# EAGLE design schematic_r2 (EAGLE 7.4.0)
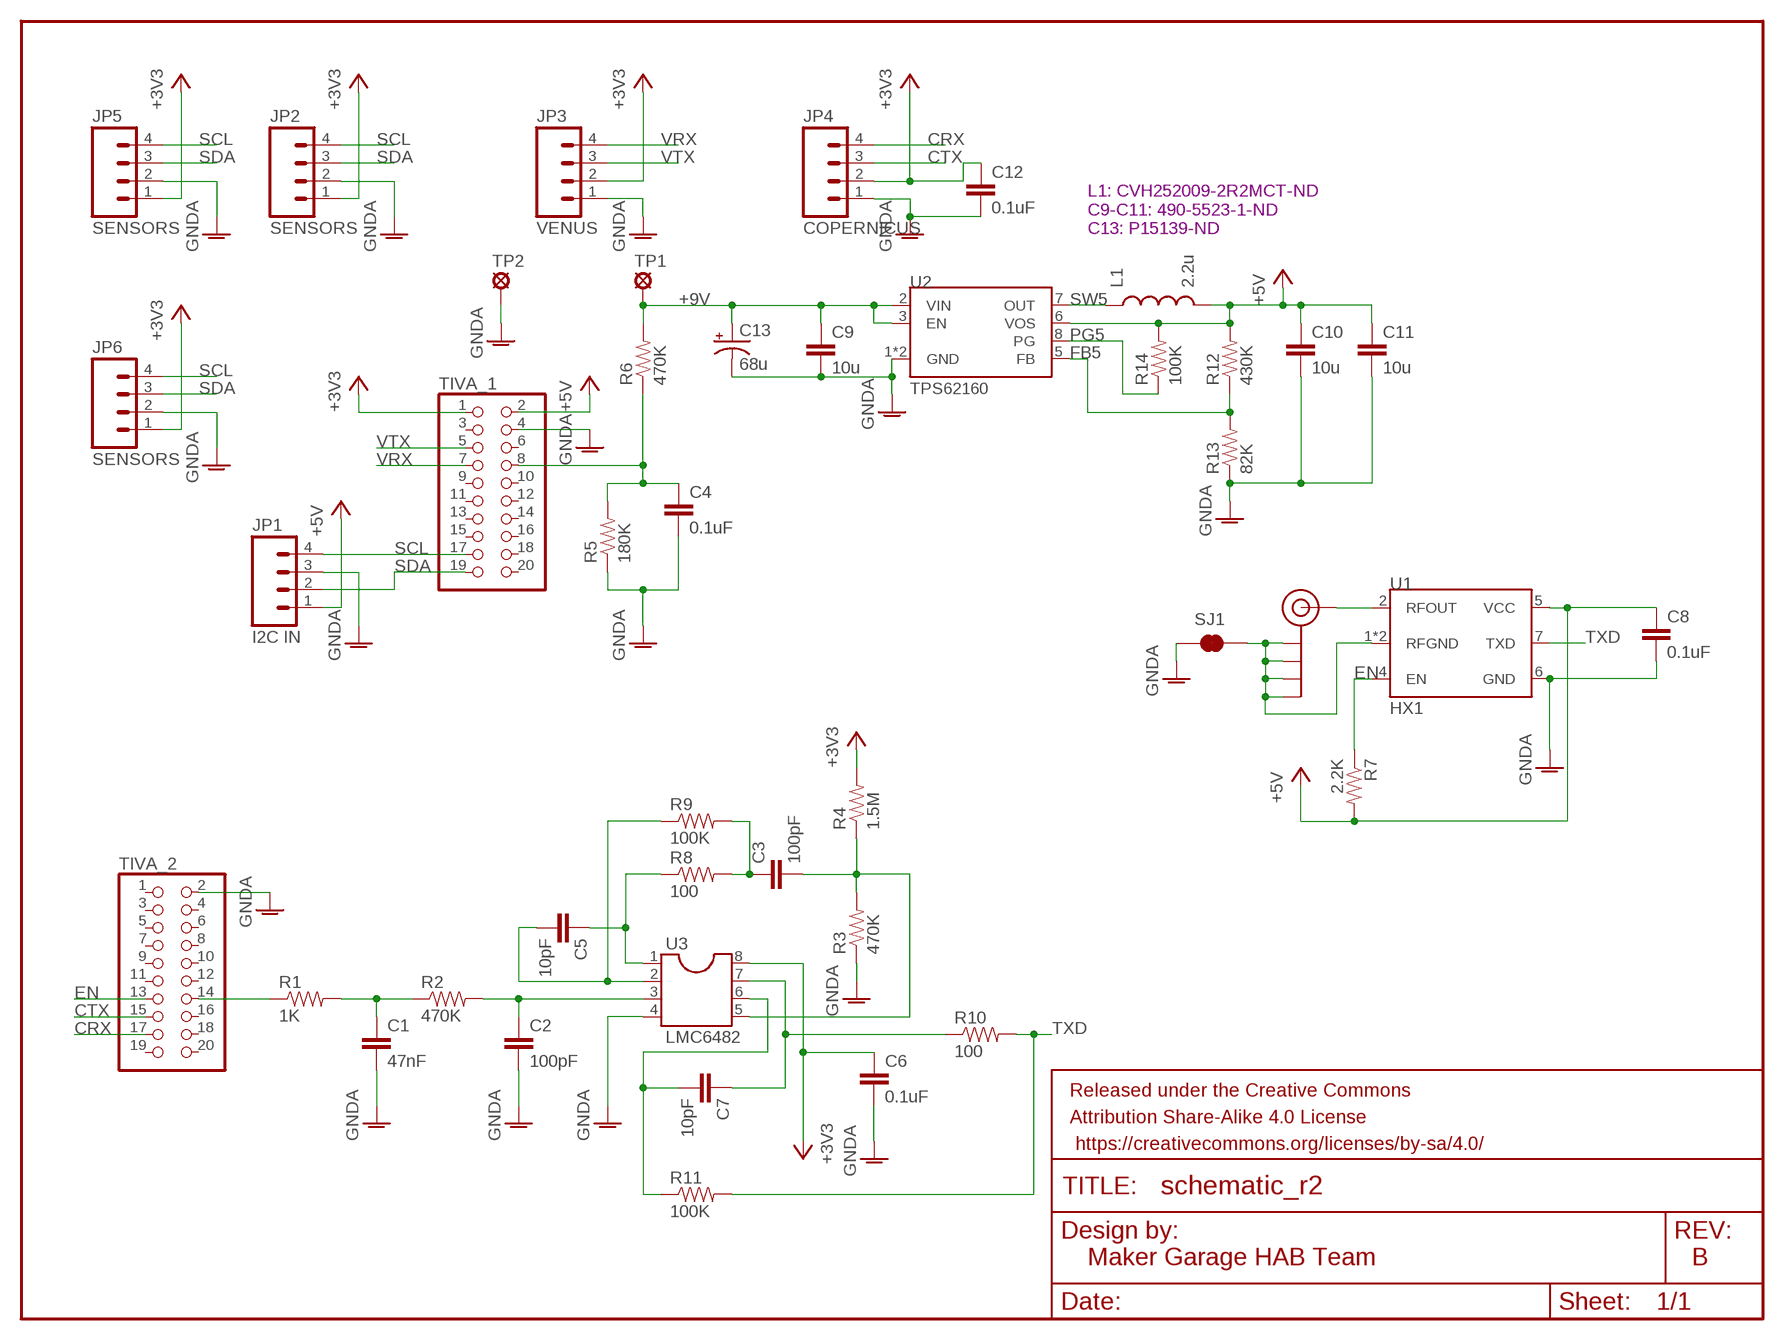
[diagram p0: schematic, sheet 1]

## Parts
C1  47nF  CAP0805  [0805]
C2  100pF  CAP0805  [0805]
C3  100pF  CAP0805  [0805]
C4  0.1uF  CAP0805  [0805]
C5  10pF  CAP0805  [0805]
C6  0.1uF  CAP0805  [0805]
C7  10pF  CAP0805  [0805]
C8  0.1uF  CAP0805  [0805]
C9  10u  CAP0805  [0805]
C10  10u  CAP0805  [0805]
C11  10u  CAP0805  [0805]
C12  0.1uF  CAP0805  [0805]
C13  68u  CAP_POLPTH2  [CPOL-RADIAL-10UF-25V]
FRAME1  FRAME-LETTERNO_PACKAGE  [DUMMY]
J1  SMA_EDGE  [SMA-EDGE]
JP1  I2C IN  M04PTH  [1X04]
JP2  SENSORS  M04PTH  [1X04]
JP3  VENUS  M04PTH  [1X04]
JP4  COPERNICUS  M04PTH  [1X04]
JP5  SENSORS  M04PTH  [1X04]
JP6  SENSORS  M04PTH  [1X04]
L1  2.2u  INDUCTOR  [1008]
R1  1K  RESISTOR0805-RES  [0805]
R2  470K  RESISTOR0805-RES  [0805]
R3  470K  RESISTOR0805-RES  [0805]
R4  1.5M  RESISTOR0805-RES  [0805]
R5  180K  RESISTOR0805-RES  [0805]
R6  470K  RESISTOR0805-RES  [0805]
R7  2.2K  RESISTOR0805-RES  [0805]
R8  100  RESISTOR0805-RES  [0805]
R9  100K  RESISTOR0805-RES  [0805]
R10  100  RESISTOR0805-RES  [0805]
R11  100K  RESISTOR0805-RES  [0805]
R12  430K  RESISTOR0805-RES  [0805]
R13  82K  RESISTOR0805-RES  [0805]
R14  100K  RESISTOR0805-RES  [0805]
SJ1  JUMPER-PAD-2-NC_BY_TRACE  [PAD-JUMPER-2-NC_BY_TRACE_YES_SILK]
TIVA_1  PINHD-2X10  [2X10]
TIVA_2  PINHD-2X10  [2X10]
TP1  MCS08  [MCS08]
TP2  MCS08  [MCS08]
U1  HX1  [1X12]
U2  TPS62160  [MSOP8]
U3  LMC6482  DIL8  [DIL08]

## Nets
+3V3: C6.1 C12.1 JP2.1 JP3.2 JP4.2 JP5.1 JP6.1 R4.2 TIVA_1.1 U3.8
+5V: C8.1 C10.1 C11.1 JP1.1 L1.2 R7.2 R12.2 R14.2 TIVA_1.2 U1.5(VCC) U2.6(VOS)
+9V: C9.1 C13.1(+) R6.2 TP1.MP U2.2(VIN) U2.3(EN)
CRX: JP4.4 TIVA_2.17
CTX: JP4.3 TIVA_2.15
EN: R7.1 TIVA_2.13 U1.4(EN)
FB5: R12.1 R13.2 U2.5(FB)
GNDA: C1.2 C2.2 C4.2 C6.2 C8.2 C9.2 C10.2 C11.2 C12.2 C13.2(-) JP1.3 JP2.2 JP3.1 JP4.1 JP5.2 JP6.2 R3.1 R5.1 R13.1 SJ1.1 TIVA_1.4 TIVA_2.2 TP2.MP U1.6(GND) U2.1(GND) U2.4(GND) U3.4
HPFB: C7.2 R11.1 U3.6
HPIN: C3.1 R8.2 R9.2
HPOUT: C3.2 R3.2 R4.1 U3.5
LPFB: C5.2 R9.1 U3.2
LPOUT: C5.1 R8.1 U3.1
PG5: R14.1 U2.8(PG)
PWMF1: C1.1 R1.2 R2.1
PWMF2: C2.1 R2.2 U3.3
PWMOUT: R1.1 TIVA_2.14
RFGND: J1.GND@0(GND) J1.GND@1(GND) J1.GND@2(GND) J1.GND@3(GND) SJ1.2 U1.1(RFGND) U1.3(RFGND)
RFOUT: J1.SIG(SIGNAL) U1.2(RFOUT)
SCL: JP1.4 JP2.4 JP5.4 JP6.4 TIVA_1.17
SDA: JP1.2 JP2.3 JP5.3 JP6.3 TIVA_1.19
SW5: L1.1 U2.7(OUT)
TXD: R10.2 R11.2 U1.7(TXD)
TXF: C7.1 R10.1 U3.7
VBAT: C4.1 R5.2 R6.1 TIVA_1.8
VRX: JP3.4 TIVA_1.7
VTX: JP3.3 TIVA_1.5
Unconnected: TIVA_1.3 TIVA_1.6 TIVA_1.9 TIVA_1.10 TIVA_1.11 TIVA_1.12 TIVA_1.13 TIVA_1.14 TIVA_1.15 TIVA_1.16 TIVA_1.18 TIVA_1.20 TIVA_2.1 TIVA_2.3 TIVA_2.4 TIVA_2.5 TIVA_2.6 TIVA_2.7 TIVA_2.8 TIVA_2.9 TIVA_2.10 TIVA_2.11 TIVA_2.12 TIVA_2.16 TIVA_2.18 TIVA_2.19 TIVA_2.20

## Notes on the sheet
- L1: CVH252009-2R2MCT-ND
  C9-C11: 490-5523-1-ND
  C13: P15139-ND
- Maker Garage HAB Team | B

## Library data of the parts
C1-C12 = SparkFun-Passives:CAP: Capacitor Standard 0603 ceramic capacitor, and 0.1" leaded capacitor.
C13 = SparkFun-Passives:CAP_POL: Capacitor Polarized These are standard SMD and PTH capacitors. Normally 10uF, 47uF, and 100uF in electrolytic and tantalum varieties. Always verify the external diameter of the through hole cap, it varies with capacity, voltage, and manufacturer. The EIA devices should be standard.
FRAME1 = SparkFun-Aesthetics:FRAME-LETTER: Schematic Frame Standard 8.5x11 US Letter frame; DESIGNER: Nobody; VERSION: v01
J1 = SparkFun-Connectors:SMA_EDGE: SMA Antenna Connector End launch SMA connector. The paste layer has been removed so that the connector can be hand soldered onto the board after reflow.
JP1-JP6 = SparkFun-Connectors:M04: Header 4 Standard 4-pin 0.1" header. Use with straight break away headers (SKU : PRT-00116), right angle break away headers (PRT-00553), swiss pins (PRT-00743), machine pins (PRT-00117), and female headers (PRT-00115). Molex polarized connector foot print use with SKU : PRT-08231 with associated crimp pins and housings. 1MM SMD Version SKU: PRT-10208
L1 = HAB:INDUCTOR: INDUCTOR Standard inductor, with some new packages Why do inductors never come in standard packages!?
R1-R14 = SparkFun-Passives:RESISTOR: Resistor Basic schematic elements and footprints for 0603, 1206, and PTH resistors.
SJ1 = SparkFun-Passives:JUMPER-PAD-2-NC_BY_TRACE
TIVA_1 TIVA_2 = pinhead:PINHD-2X10: PIN HEADER
TP1 TP2 = solpad:MCS08: SOLDER PAD MC S0,8, drill 1.2 mm, distributor Buerklin, 08F130
U1 = HAB:HX1: Radiometrix HX1 High-power VHF Narrow Band 300 mW Transmitter
U2 = HAB:TPS62160: TPS62160 Adjustable switch-mode D-CAP2 regulator
U3 = ic-package:DIL8: Dual In Line / Socket

## Board
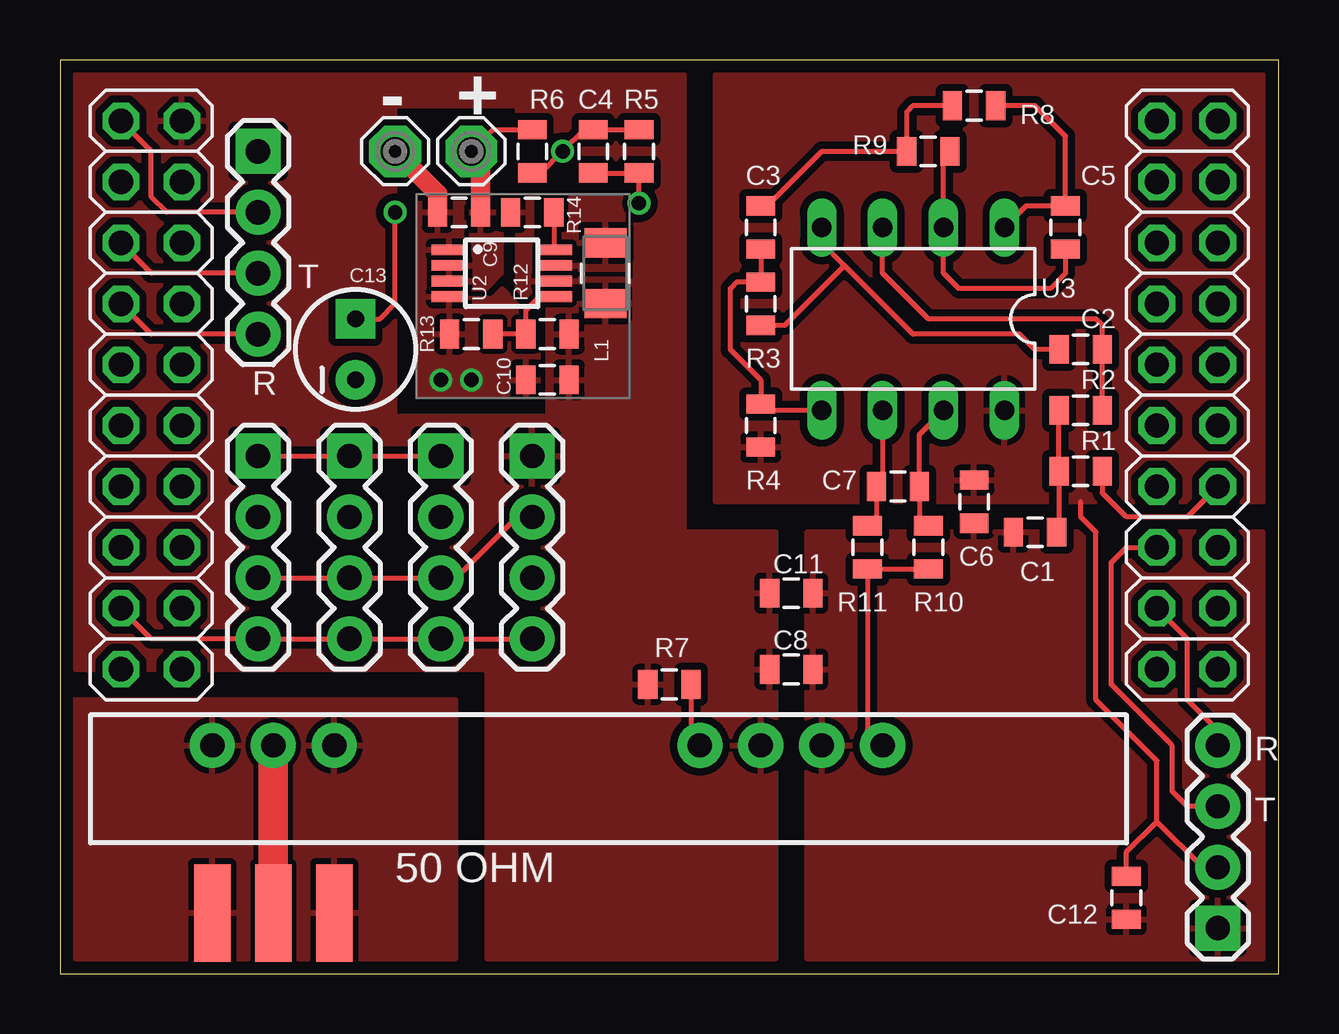
[diagram p1: board, top side]
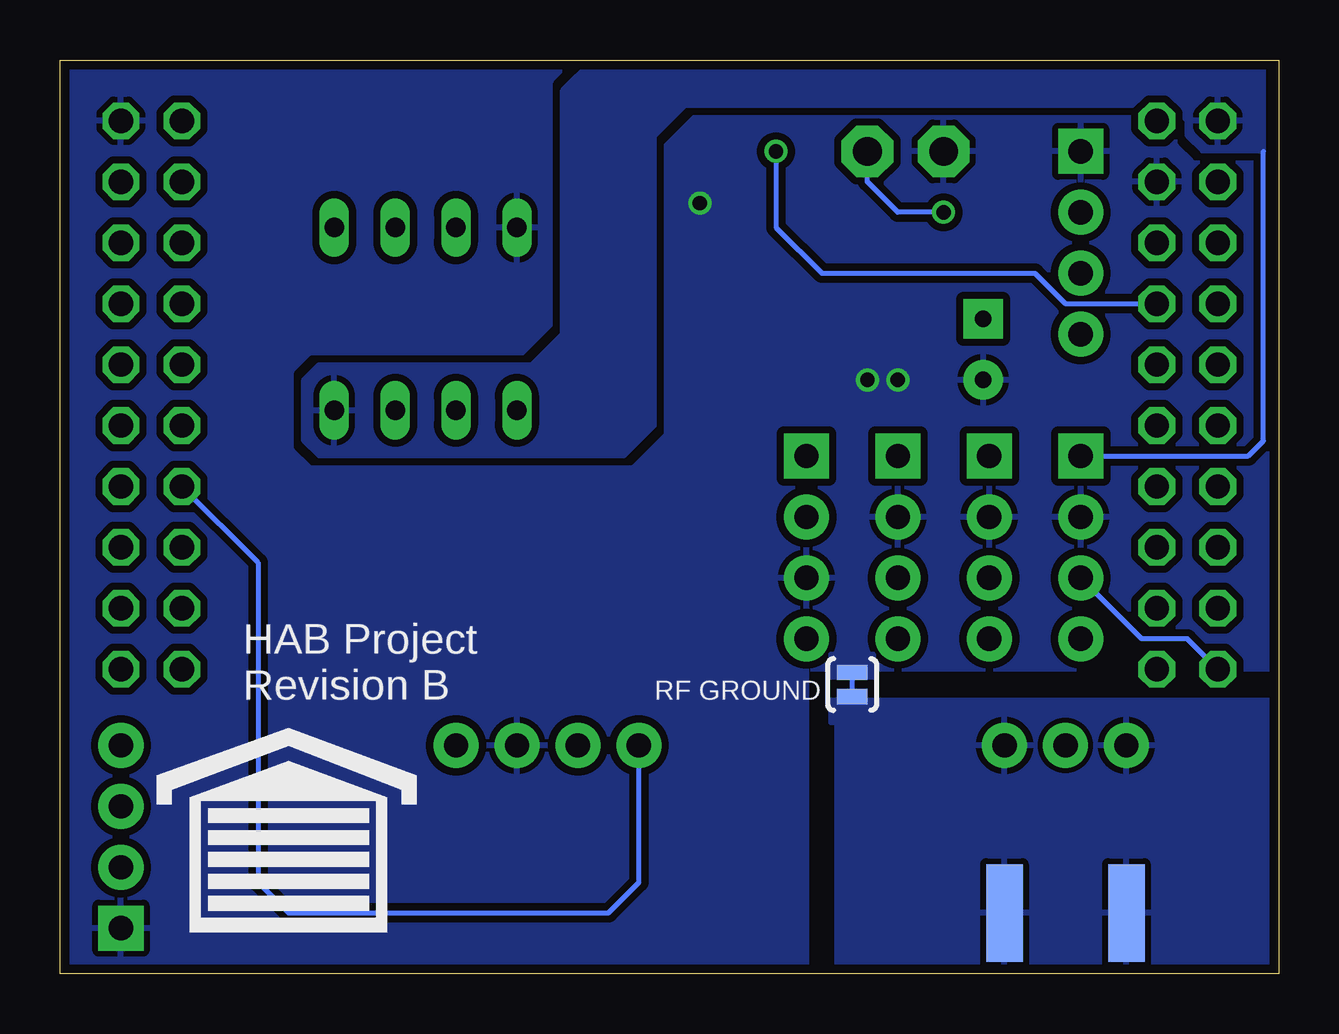
[diagram p2: board, bottom side, seen from below]

Size 50.8 x 38.1 mm. Coordinates in mm from the lower left corner, seen from the top.
Outline: 0,0 50.8,0 50.8,38.1 0,38.1 0,0
Copper layers (1*16): Top 0.0356mm / dielectric 1.5011mm / Bottom 0.0356mm
Design rules "LaenPCBOrder *": minimum track width 6mil, minimum drill 13mil, track to track 6mil, track to pad 6mil, pad to pad 6mil, via to via 6mil, smd to smd 6mil, copper to edge 15mil, drill to drill 6mil, minimum pad ring 7mil, minimum via ring 7mil, stop-mask expansion 3mil, vias tented up to drill 0mil, thermal gap 10mil

### Footprints (pad centres in the part's own frame; a part is rotated, then mirrored left to right if it is on the bottom)
0805 = smd 0.8 x 1.2: 1 -0.9,0; 2 0.9,0
CPOL-RADIAL-10UF-25V = drill 0.7 pad 1.651 square: 1 1.27,0 | drill 0.7 pad 1.651: 2 -1.27,0
SMA-EDGE = smd 1.524 x 4.064: GND@0 0,0; GND@1 5.08,0; SIG 2.54,0 | smd 1.524 x 4.064 bottom: GND@2 0,0; GND@3 5.08,0
1X04 = drill 1.016 pad 1.88 square: 1 0,0 | drill 1.016 pad 1.88: 2 2.54,0; 3 5.08,0; 4 7.62,0
1008 = smd 1.753 x 1.219: 1 0,1.27; 2 0,-1.27
PAD-JUMPER-2-NC_BY_TRACE_YES_SILK = smd 0.635 x 1.27: 1 -0.508,0; 2 0.508,0
2X10 = drill 1.016 octagon: 1 -11.43,-1.27; 2 -11.43,1.27; 3 -8.89,-1.27; 4 -8.89,1.27; 5 -6.35,-1.27; 6 -6.35,1.27; 7 -3.81,-1.27; 8 -3.81,1.27; 9 -1.27,-1.27; 10 -1.27,1.27; 11 1.27,-1.27; 12 1.27,1.27; 13 3.81,-1.27; 14 3.81,1.27; 15 6.35,-1.27; 16 6.35,1.27; 17 8.89,-1.27; 18 8.89,1.27; 19 11.43,-1.27; 20 11.43,1.27
MCS08 = drill 1.194 pad 2.159 octagon: MP 0,0
1X12 = drill 1.016 pad 1.88: 1 0,0; 2 2.54,0; 3 5.08,0; 4 20.32,0; 5 22.86,0; 6 25.4,0; 7 27.94,0
MSOP8 = smd 0.45 x 1.45: 1 -0.975,-2.2; 2 -0.325,-2.2; 3 0.325,-2.2; 4 0.975,-2.2; 5 0.975,2.2; 6 0.325,2.2; 7 -0.325,2.2; 8 -0.975,2.2
DIL08 = drill 0.813 long: 1 -3.81,-3.81; 2 -1.27,-3.81; 3 1.27,-3.81; 4 3.81,-3.81; 5 3.81,3.81; 6 1.27,3.81; 7 -1.27,3.81; 8 -3.81,3.81

### Placement (x,y rotation side)
C1  40.64,18.41 180 top
C2  42.55,26.04 180 top
C3  29.21,31.11 270 top
C4  22.23,34.29 270 top
C5  41.91,31.11 270 top
C6  38.1,19.68 270 top
C7  34.92,20.32 180 top
C8  30.48,12.7 0 top
C9  16.64,31.75 180 top
C10  20.32,24.77 180 top
C11  30.48,15.88 0 top
C12  44.45,3.17 270 top
C13  12.32,26.04 90 top
FRAME1  0,39.37 0 top
J1  6.35,2.54 0 top
JP1  19.68,21.59 270 top
JP2  8.26,21.59 270 top
JP3  8.26,34.29 270 top
JP4  48.26,1.91 90 top
JP5  12.06,21.59 270 top
JP6  15.88,21.59 270 top
L1  22.73,29.21 0 top
R1  42.55,20.95 180 top
R2  42.55,23.5 0 top
R3  29.21,27.94 90 top
R4  29.21,22.86 270 top
R5  24.13,34.29 90 top
R6  19.68,34.29 90 top
R7  25.4,12.06 180 top
R8  38.1,36.2 180 top
R9  36.2,34.29 180 top
R10  36.2,17.78 270 top
R11  33.66,17.78 270 top
R12  20.32,26.67 0 top
R13  17.14,26.67 0 top
R14  19.68,31.75 180 top
SJ1  17.78,12.06 270 bottom
TIVA_1  3.81,24.13 270 top
TIVA_2  46.99,24.13 270 top
TP1  17.14,34.29 0 top
TP2  13.97,34.29 0 top
U1  6.35,9.53 0 top
U2  18.41,29.21 270 top
U3  35.56,27.3 180 top
U$1  [GARAGE]  41.27,5.08 0 bottom

### Tracks (layer width: path | path; a pad name or v marks a point on that pad's centre or on a via)
+3V3
  Top 0.203: JP4.2 47.62,4.45 45.72,6.35 | 45.72,6.35 45.72,8.89 43.18,11.43 43.18,18.41 42.55,19.05 42.55,19.68 | C12.1 44.45,5.08 45.72,6.35 | JP3.2 4.45,31.75 3.81,32.38 3.81,34.29 TIVA_1.1 | JP2.1 JP5.1 JP6.1
  Bottom 0.203: JP2.1 1.27,21.59 0.64,22.23 0.64,34.29
  pour Top (isolate 0.305, rank 3): 27.3,19.68 50.16,19.68 50.16,37.47 27.3,37.47
  pour Bottom (isolate 0.305): 0.64,38.1 0.64,34.29 3.17,34.29 3.81,34.92 3.81,35.56 4.45,36.2 24.77,36.2 26.04,34.92 26.04,22.86 27.3,21.59 40.01,21.59 40.64,22.23 40.64,24.77 40.01,25.4 31.11,25.4 29.84,26.67 29.84,36.83 28.57,38.1
+5V
  pour Top (isolate 0.305, rank 3): 0.64,37.47 0.64,12.7 17.78,12.7 17.78,0.64 29.84,0.64 29.84,18.41 26.04,18.41 26.04,34.92 21.59,34.92 21.59,25.4 20.32,25.4 20.32,23.24 13.97,23.24 13.97,36.2 26.04,36.2 26.04,37.47
  pour Top (isolate 0.203): 20.32,24.13 23.5,24.13 23.5,28.96 19.94,28.96 19.68,29.21 19.68,32.38 19.05,32.38 19.05,28.57 19.68,27.94 20.32,27.94
  pour Top (isolate 0.305): 19.05,36.2 19.05,34.92 26.04,34.92 26.04,36.2
+9V  (via drill 0.6)
  Top 0.203: TP1.MP 18.05,35.19 R6.2 | C13.1 13.34,27.3 13.97,27.94 v13.97,31.75
  Top 0.813: C9.1 17.54,33.9 TP1.MP
  Bottom 0.203: v13.97,31.75 15.88,31.75 17.14,33.02 TP1.MP
  pour Top (isolate 0.203): 15.75,28.57 17.78,28.57 18.41,29.21 18.41,32.38 17.14,32.38 17.14,29.84 15.75,29.84
CRX
  Top 0.203: JP4.4 48.26,10.16 46.99,11.43 46.99,13.97 TIVA_2.17
CTX
  Top 0.203: JP4.3 46.99,6.99 46.35,7.62 46.35,9.53 43.81,12.06 43.81,17.14 44.45,17.78 TIVA_2.15
EN
  Top 0.203: R7.1 26.3,9.89 U1.4
  Bottom 0.203: U1.4 26.67,3.81 27.94,2.54 41.27,2.54 42.55,3.81 42.55,17.14 TIVA_2.13
FB5
  Top 0.203: R13.2 R12.1 19.42,27.68 19.98,28.23 U2.5
GNDA  (via drill 0.6)
  Top 0.203: C2.2 40.64,26.04 40.01,26.67 35.56,26.67 32.7,29.53 | 32.7,29.53 31.75,30.48 U3.4 | R3.1 30.21,27.04 32.7,29.53 | C4.2 R5.1 v24.13,32.13
  Top 0.813: C9.2 15.74,32.52 TP2.MP
  other vias: 17.14,24.77 15.88,24.77
  pour Bottom (isolate 0.305, rank 3): 50.8,0 50.8,38.1 0,38.1 0,12.7 19.68,12.7 19.68,0
  pour Top (isolate 0.305, rank 3): 31.11,18.41 31.11,0.64 50.16,0.64 50.16,18.41
  pour Bottom (rank 2, no thermals): 16.89,13.34 16.89,12.37 18.67,12.37 18.67,13.34
  pour Top (isolate 0.203, rank 2): 14.99,24.13 19.94,24.13 19.94,27.94 19.05,27.94 17.78,29.21 17.78,32.13 14.99,32.13
HPFB
  Top 0.203: U3.6 34.29,20.59 C7.2 34.02,19.05 R11.1
HPIN
  Top 0.203: R8.2 35.56,36.2 35.3,35.93 R9.2 31.75,34.29 29.48,32.02 C3.1
HPOUT
  Top 0.203: C3.2 R3.2 28.2,28.84 27.94,28.57 27.94,26.04 29.21,24.77 R4.1 29.48,23.5 U3.5
LPFB
  Top 0.203: C5.2 41.91,29.21 41.27,28.57 37.47,28.57 36.83,29.21 U3.2 36.83,34.02 R9.1
LPOUT
  Top 0.203: R8.1 40.64,36.2 41.91,34.92 C5.1 40.27,32.02 U3.1
PG5
  Top 0.203: U2.8 20.61,31.72 R14.1
PWMF1
  Top 0.203: R2.1 R1.2 41.65,18.52 C1.1
PWMF2
  Top 0.203: R2.2 C2.1 43.45,27.04 43.18,27.3 36.2,27.3 34.29,29.21 U3.3
PWMOUT
  Top 0.203: R1.1 43.45,20.05 44.45,19.05 46.99,19.05 TIVA_2.14
RFGND
  pour Top (isolate 0.203, rank 3): 0.64,11.43 0.64,0.64 16.51,0.64 16.51,11.43
  pour Bottom (isolate 0.203): 0,11.43 0,0 18.41,0 18.41,11.43
  pour Bottom (rank 2, no thermals): 16.89,11.43 16.89,10.46 18.67,10.46 18.67,11.43
RFOUT
  Top 1.232: U1.2 J1.SIG
SCL
  Top 0.203: JP1.4 JP6.4 JP5.4 JP2.4 3.81,13.97 TIVA_1.17
SDA
  Top 0.203: JP2.3 JP5.3 JP6.3 16.51,16.51 19.05,19.05 JP1.2
  Bottom 0.203: TIVA_1.19 3.81,13.97 5.71,13.97 JP2.3
SW5
  pour Top (isolate 0.203, rank 2): 20.95,32.38 20.95,29.21 23.5,29.21 23.5,32.38
TXD
  Top 0.203: R10.2 R11.2 33.66,10.16 U1.7
TXF
  Top 0.203: U3.7 35.83,22.49 C7.1 35.83,19.05 R10.1
VBAT  (via drill 0.6)
  Top 0.203: R5.2 C4.1 21.86,35.19 v20.95,34.29 20.05,33.39 R6.1
  Bottom 0.203: v20.95,34.29 20.95,31.11 19.05,29.21 10.16,29.21 8.89,27.94 TIVA_1.8
VRX
  Top 0.203: JP3.4 3.81,26.67 TIVA_1.7
VTX
  Top 0.203: JP3.3 3.81,29.21 TIVA_1.5

### Text on the board
tPlace: - | + | T | R | R | T | 50 OHM
bPlace: RF GROUND | HAB Project / Revision B